# EAGLE board FlexEval (EAGLE 9.6.2)
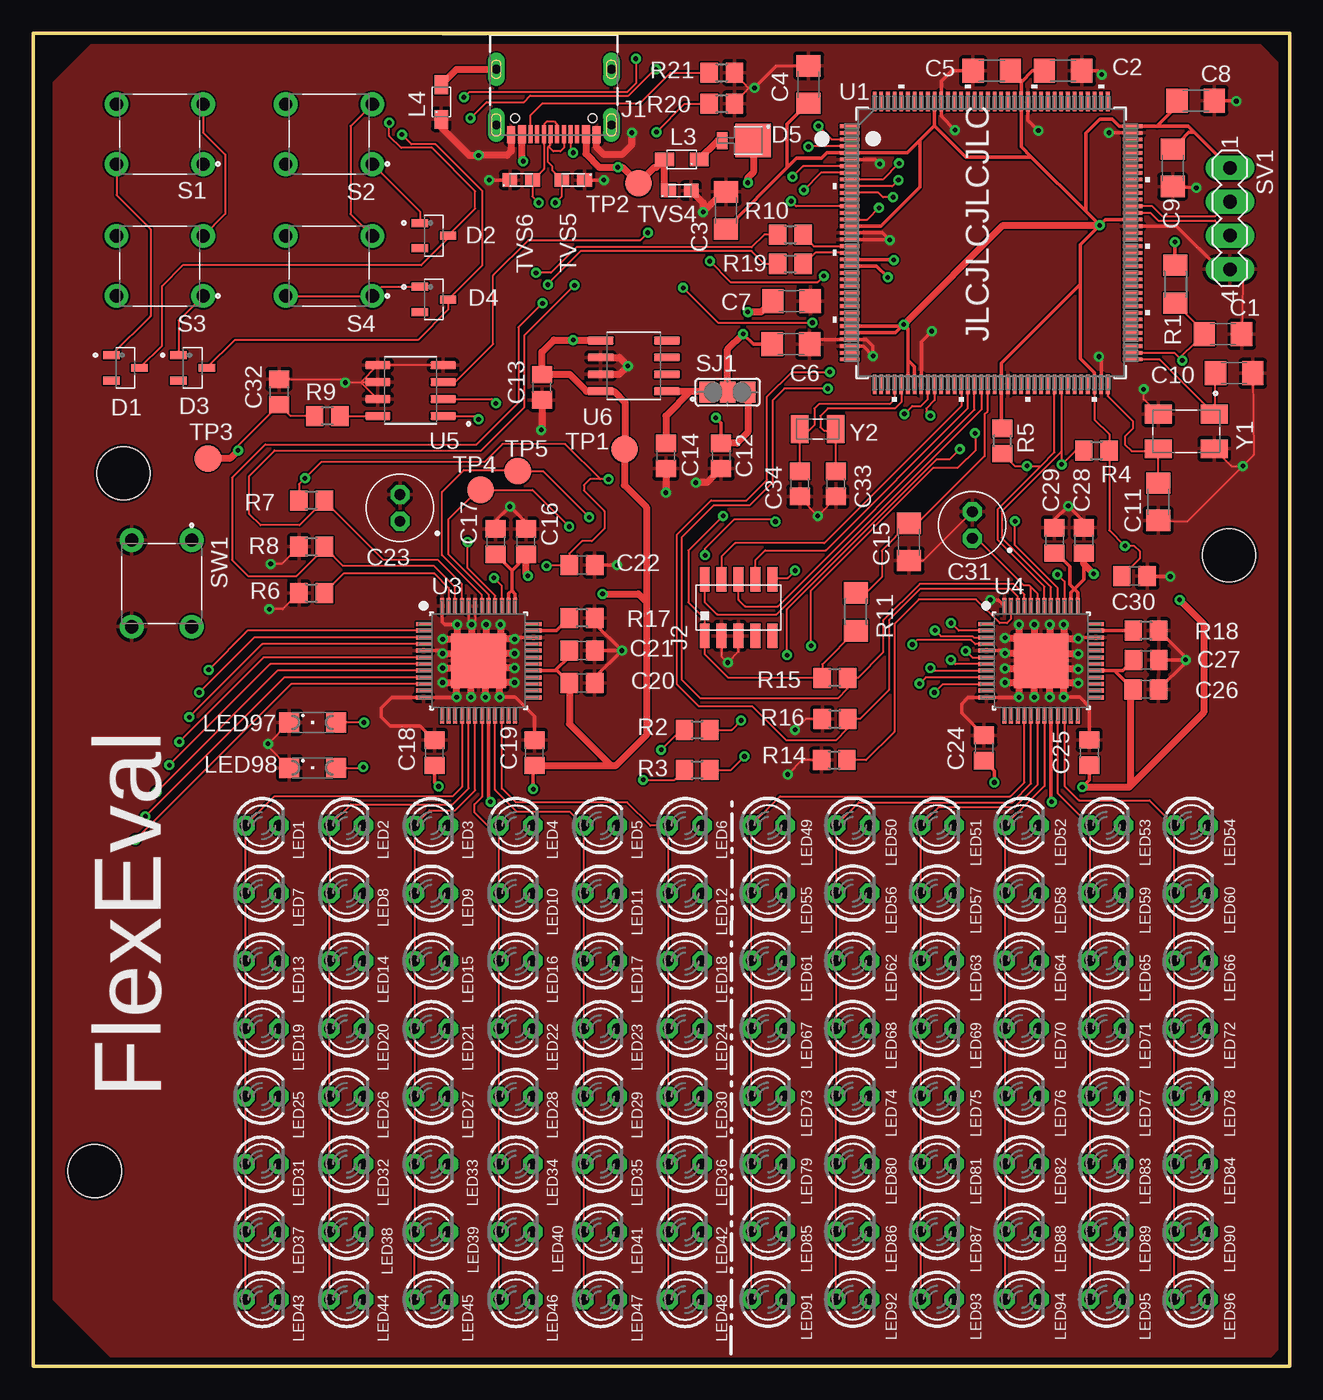
[diagram p5: board, top side]
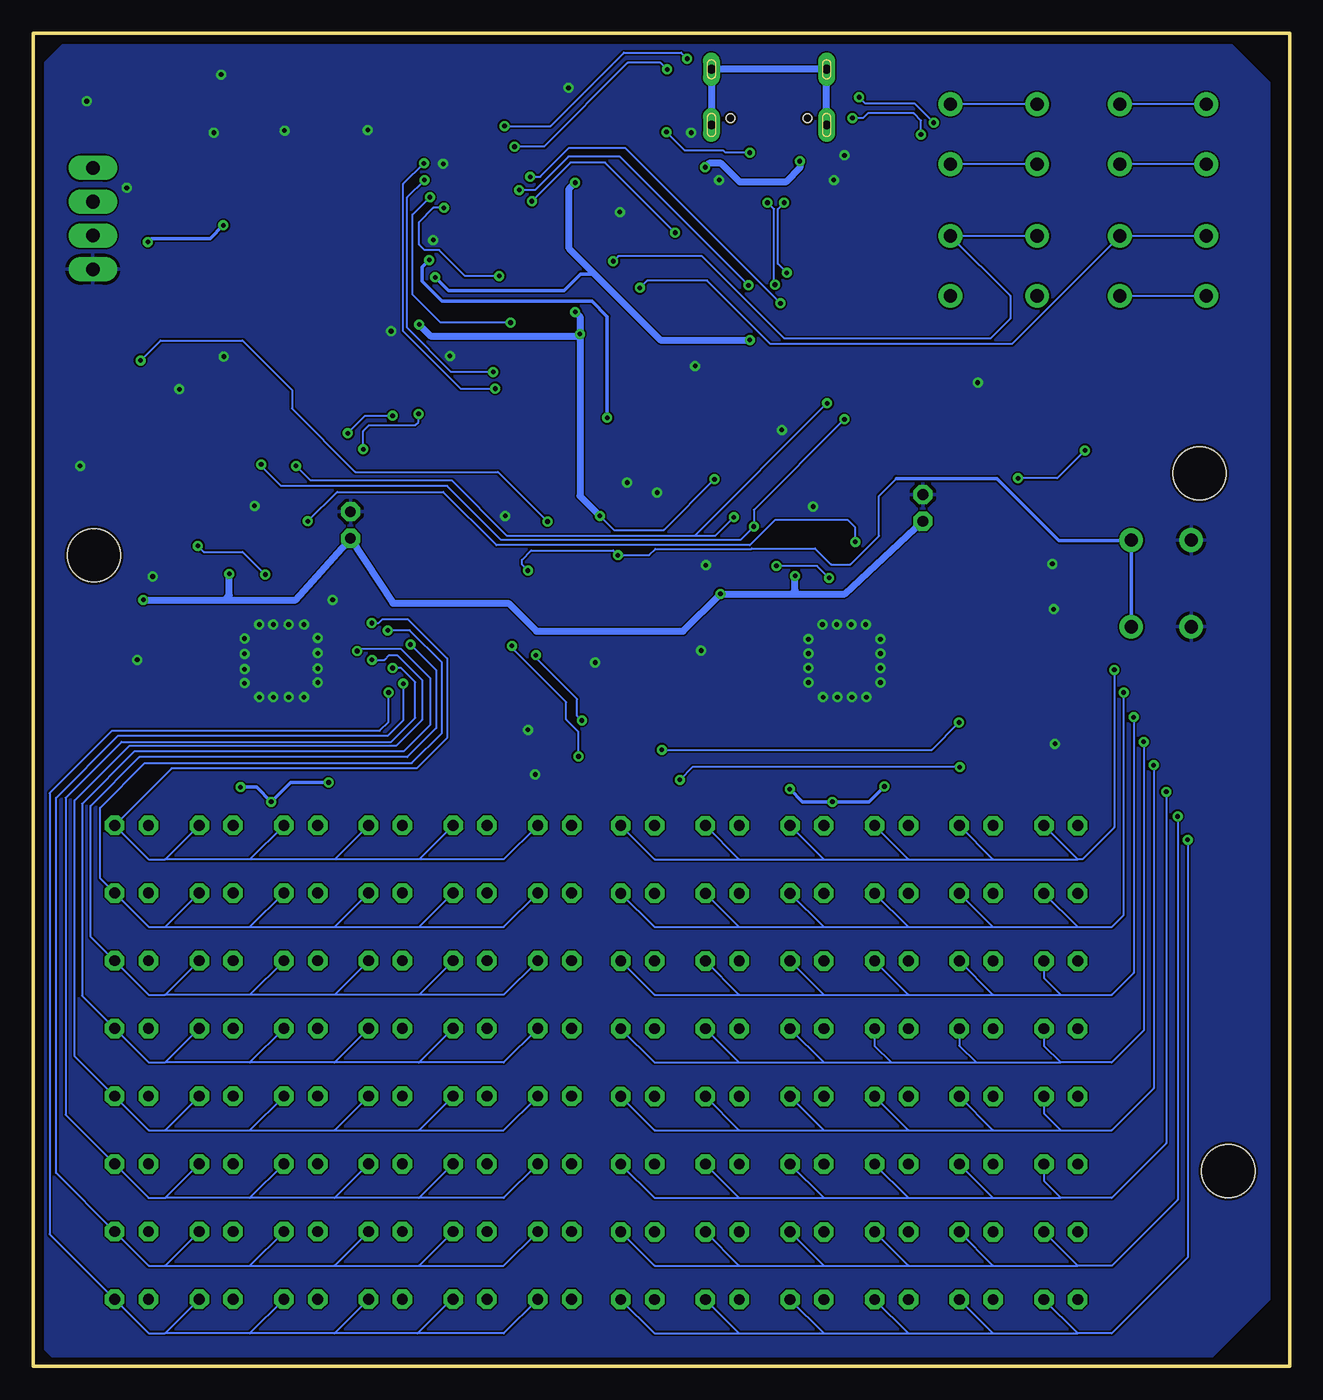
[diagram p6: board, bottom side, seen from below]

Size 94.25 x 100 mm. Coordinates in mm from the lower left corner, seen from the top.
Outline: 0,0 94.25,0 94.25,100 0,100 0,0
Copper layers (1*16): Top 0.035mm / dielectric 1.6mm / Bottom 0.035mm
Design rules "jlcpcb-2layers *": minimum track width 5mil, minimum drill 0.3mm, track to track 5mil, track to pad 5mil, pad to pad 5mil, via to via 0.5mm, smd to smd 5mil, copper to edge 0.2mm, drill to drill 6mil, minimum pad ring 0.3mm, minimum via ring 0.2mm, stop-mask expansion 4mil, vias tented up to drill 0mil, thermal gap 10mil
Holes 4 mm at 6.75,67 4.6,14.65 89.7,60.85

## Footprints (pad centres in the part's own frame; a part is rotated, then mirrored left to right if it is on the bottom)
C1206 = smd 1.6 x 1.8: 1 -1.4,0; 2 1.4,0
C0805 = smd 1.3 x 1.5: 1 -0.95,0; 2 0.95,0
860020672011 = drill 0.8 octagon: + 0,1; - 0,-1
SOT95P240X111-3N = smd 1.23 x 0.6: 1 -1.06,0.95; 2 -1.06,-0.95; 3 1.06,0
UPS115UE3/TR7 = smd 2.667 x 2.54: 1 -1.651,0 | smd 0.762 x 1.27: 2 0.686,0
GCT_USB4105-GF-A = smd 0.6 x 1.25: A1_B12 -3.2,4.905; B1_A12 3.2,4.905 | smd 0.6 x 1.35: A4_B9 -2.4,4.855; B4_A9 2.4,4.855 | smd 0.3 x 1.35: A5 -1.25,4.855; A6 -0.25,4.855; A7 0.25,4.855; A8 1.25,4.855; B5 1.75,4.855; B6 0.75,4.855; B7 -0.75,4.855; B8 -1.75,4.855 | drill 0.66 pad 1.05 long: S1 -4.32,4.18; S4 4.32,4.18 | drill 0.66 pad 1 long: S2 -4.32,0; S3 4.32,0 | hole 0.65: 2.89,3.68; -2.89,3.68
DEBUG = smd 1.854 x 0.737: 1 -2.121,2.54; 2 2.121,2.54; 3 -2.121,1.27; 4 2.121,1.27; 5 -2.121,0; 6 2.121,0; 7 -2.121,-1.27; 8 2.121,-1.27; 9 -2.121,-2.54; 10 2.121,-2.54
78285333 = smd 1.4 x 1: 1 -1.3,0; 2 1.3,0
LED3MM = drill 0.813 octagon: A -1.27,0; K 1.27,0
SML1206 = smd 1.5 x 1.5: A 1.75,0; C -1.75,0
R1206 = smd 1.6 x 1.803: 1 -1.422,0; 2 1.422,0
R0805 = smd 1.3 x 1.5: 1 -0.95,0; 2 0.95,0
SW_1825910-7 = drill 0.99: 1 -3.25,2.25; 2 3.25,2.25; 3 -3.25,-2.25; 4 3.25,-2.25
SJ_2 = smd 1.168 x 1.6: 1 -1.524,0; 2 0,0; 3 1.524,0
MA04-1 = drill 1.016 long: 1 -3.81,0; 2 -1.27,0; 3 1.27,0; 4 3.81,0
TP20R = smd 2 x 2: TP 0,0
0603ESDA2-TR2 = smd 1.1 x 1: 1 -0.85,0; 2 0.85,0
LQFP-144_20X20X1.6 = smd 1.461 x 0.27: 1 -10.498,8.75; 2 -10.498,8.25; 3 -10.498,7.75; 4 -10.498,7.25; 5 -10.498,6.75; 6 -10.498,6.25; 7 -10.498,5.75; 8 -10.498,5.25; 9 -10.498,4.75; 10 -10.498,4.25; 11 -10.498,3.75; 12 -10.498,3.25; 13 -10.498,2.75; 14 -10.498,2.25; 15 -10.498,1.75; 16 -10.498,1.25; 17 -10.498,0.75; 18 -10.498,0.25; 19 -10.498,-0.25; 20 -10.498,-0.75; 21 -10.498,-1.25; 22 -10.498,-1.75; 23 -10.498,-2.25; 24 -10.498,-2.75; 25 -10.498,-3.25; 26 -10.498,-3.75; 27 -10.498,-4.25; 28 -10.498,-4.75; 29 -10.498,-5.25; 30 -10.498,-5.75; 31 -10.498,-6.25; 32 -10.498,-6.75; 33 -10.498,-7.25; 34 -10.498,-7.75; 35 -10.498,-8.25; 36 -10.498,-8.75; 73 10.752,-8.75; 74 10.752,-8.25; 75 10.752,-7.75; 76 10.752,-7.25; 77 10.752,-6.75; 78 10.752,-6.25; 79 10.752,-5.75; 80 10.752,-5.25; 81 10.752,-4.75; 82 10.752,-4.25; 83 10.752,-3.75; 84 10.752,-3.25; 85 10.752,-2.75; 86 10.752,-2.25; 87 10.752,-1.75; 88 10.752,-1.25; 89 10.752,-0.75; 90 10.752,-0.25; 91 10.752,0.25; 92 10.752,0.75; 93 10.752,1.25; 94 10.752,1.75; 95 10.752,2.25; 96 10.752,2.75; 97 10.752,3.25; 98 10.752,3.75; 99 10.752,4.25; 100 10.752,4.75; 101 10.752,5.25; 102 10.752,5.75; 103 10.752,6.25; 104 10.752,6.75; 105 10.752,7.25; 106 10.752,7.75; 107 10.752,8.25; 108 10.752,8.75 | smd 0.27 x 1.461: 37 -8.623,-10.625; 38 -8.123,-10.625; 39 -7.623,-10.625; 40 -7.123,-10.625; 41 -6.623,-10.625; 42 -6.123,-10.625; 43 -5.623,-10.625; 44 -5.123,-10.625; 45 -4.623,-10.625; 46 -4.123,-10.625; 47 -3.623,-10.625; 48 -3.123,-10.625; 49 -2.623,-10.625; 50 -2.123,-10.625; 51 -1.623,-10.625; 52 -1.123,-10.625; 53 -0.623,-10.625; 54 -0.123,-10.625; 55 0.377,-10.625; 56 0.877,-10.625; 57 1.377,-10.625; 58 1.877,-10.625; 59 2.377,-10.625; 60 2.877,-10.625; 61 3.377,-10.625; 62 3.877,-10.625; 63 4.377,-10.625; 64 4.877,-10.625; 65 5.377,-10.625; 66 5.877,-10.625; 67 6.377,-10.625; 68 6.877,-10.625; 69 7.377,-10.625; 70 7.877,-10.625; 71 8.377,-10.625; 72 8.877,-10.625; 109 8.877,10.625; 110 8.377,10.625; 111 7.877,10.625; 112 7.377,10.625; 113 6.877,10.625; 114 6.377,10.625; 115 5.877,10.625; 116 5.377,10.625; 117 4.877,10.625; 118 4.377,10.625; 119 3.877,10.625; 120 3.377,10.625; 121 2.877,10.625; 122 2.377,10.625; 123 1.877,10.625; 124 1.377,10.625; 125 0.877,10.625; 126 0.377,10.625; 127 -0.123,10.625; 128 -0.623,10.625; 129 -1.123,10.625; 130 -1.623,10.625; 131 -2.123,10.625; 132 -2.623,10.625; 133 -3.123,10.625; 134 -3.623,10.625; 135 -4.123,10.625; 136 -4.623,10.625; 137 -5.123,10.625; 138 -5.623,10.625; 139 -6.123,10.625; 140 -6.623,10.625; 141 -7.123,10.625; 142 -7.623,10.625; 143 -8.123,10.625; 144 -8.623,10.625
IS31FL3733B-TQLS4 = smd 1.17 x 0.3: 1 -4.12,2.75; 2 -4.12,2.25; 3 -4.12,1.75; 4 -4.12,1.25; 5 -4.12,0.75; 6 -4.12,0.25; 7 -4.12,-0.25; 8 -4.12,-0.75; 9 -4.12,-1.25; 10 -4.12,-1.75; 11 -4.12,-2.25; 12 -4.12,-2.75; 25 4.12,-2.75; 26 4.12,-2.25; 27 4.12,-1.75; 28 4.12,-1.25; 29 4.12,-0.75; 30 4.12,-0.25; 31 4.12,0.25; 32 4.12,0.75; 33 4.12,1.25; 34 4.12,1.75; 35 4.12,2.25; 36 4.12,2.75 | smd 0.3 x 1.17: 13 -2.75,-4.12; 14 -2.25,-4.12; 15 -1.75,-4.12; 16 -1.25,-4.12; 17 -0.75,-4.12; 18 -0.25,-4.12; 19 0.25,-4.12; 20 0.75,-4.12; 21 1.25,-4.12; 22 1.75,-4.12; 23 2.25,-4.12; 24 2.75,-4.12; 37 2.75,4.12; 38 2.25,4.12; 39 1.75,4.12; 40 1.25,4.12; 41 0.75,4.12; 42 0.25,4.12; 43 -0.25,4.12; 44 -0.75,4.12; 45 -1.25,4.12; 46 -1.75,4.12; 47 -2.25,4.12; 48 -2.75,4.12 | smd 4.11 x 4.11: PAD 0,0
SOIC127P600X175-8N = smd 1.9 x 0.6: 1 -2.455,1.905; 2 -2.455,0.635; 3 -2.455,-0.635; 4 -2.455,-1.905; 5 2.455,-1.905; 6 2.455,-0.635; 7 2.455,0.635; 8 2.455,1.905
SOIC127P600X175-8N' = smd 1.95 x 0.59: 1 -2.48,1.905; 2 -2.48,0.635; 3 -2.48,-0.635; 4 -2.48,-1.905; 5 2.48,-1.905; 6 2.48,-0.635; 7 2.48,0.635; 8 2.48,1.905
OSC_ABM3B-8.000MHZ-B2-T = smd 1.4 x 2: 1 -1.3,2.1; 2 -1.3,-2.1; 3 1.3,-2.1; 4 1.3,2.1
XTAL_ABS07-32.768KHZ-T = smd 1.3 x 2.1: 1 -1.35,0; 2 1.35,0

## Placement (x,y rotation side)
C1  1000pF  [C1206]  89.26,77.43 0 top
C2  1uF  [C1206]  77.26,97.18 0 top
C3  1uF  [C1206]  51.97,86.71 90 top
C4  1uF  [C1206]  58.17,96.16 90 top
C5  100nF  [C1206]  71.91,97.18 0 top
C6  100nF  [C1206]  56.84,76.67 180 top
C7  100nF  [C1206]  56.89,79.92 180 top
C8  1uF  [C1206]  87.21,94.96 0 top
C9  100nF  [C1206]  85.49,89.91 90 top
C10  22pF  [C1206]  90.09,74.49 180 top
C11  22pF  [C1206]  84.39,64.86 90 top
C12  2.2uF  [C0805]  51.6,68.3 90 top
C13  4.7uF  [C0805]  38.15,73.45 90 top
C14  4.7uF  [C0805]  47.45,68.3 90 top
C15  1000pF  [C1206]  65.71,61.84 270 top
C16  0.1uF  [C0805]  36.96,61.87 90 top
C17  0.47uF  [C0805]  34.69,61.87 90 top
C18  0.1uF  [C0805]  30.09,46.02 90 top
C19  0.47uF  [C0805]  37.59,46.02 90 top
C20  0.1uF  [C0805]  41.17,51.26 0 top
C21  0.47uF  [C0805]  41.17,53.69 0 top
C22  0.47uF  [C0805]  41.17,60.11 0 top
C23  22uF  [860020672011]  27.51,64.39 180 top
C24  0.1uF  [C0805]  71.33,46.38 90 top
C25  0.47uF  [C0805]  79.23,46.03 90 top
C26  0.1uF  [C0805]  83.47,50.78 0 top
C27  0.47uF  [C0805]  83.49,52.98 0 top
C28  0.1uF  [C0805]  78.82,61.96 90 top
C29  0.47uF  [C0805]  76.62,61.96 90 top
C30  0.47uF  [C0805]  82.62,59.28 0 top
C31  22uF  [860020672011]  70.45,63.11 180 top
C32  0.1uF  [C0805]  18.44,73.1 90 top
C33  12pF  [C0805]  60.2,66.2 270 top
C34  12pF  [C0805]  57.5,66.2 270 top
D1  BAS16LT3G  [SOT95P240X111-3N]  6.91,74.9 0 top
D2  BAS16LT3G  [SOT95P240X111-3N]  30.06,84.82 0 top
D3  BAS16LT3G  [SOT95P240X111-3N]  11.96,74.9 0 top
D4  BAS16LT3G  [SOT95P240X111-3N]  30.06,80.03 0 top
D5  UPS115UE3/TR7  [UPS115UE3/TR7]  52.37,91.96 180 top
J1  USB4105-GF-A  [GCT_USB4105-GF-A]  39.05,97.3 180 top
J2  GRPB052VWQS-RC  [DEBUG]  52.91,56.92 90 top
L3  330  [78285333]  48.65,90.55 0 top
L4  330  [78285333]  30.6,94.85 270 top
LED1  [LED3MM]  17.16,40.56 0 top
LED2  [LED3MM]  23.51,40.56 0 top
LED3  [LED3MM]  29.86,40.56 0 top
LED4  [LED3MM]  36.21,40.56 0 top
LED5  [LED3MM]  42.56,40.56 0 top
LED6  [LED3MM]  48.91,40.56 0 top
LED7  [LED3MM]  17.16,35.48 0 top
LED8  [LED3MM]  23.51,35.48 0 top
LED9  [LED3MM]  29.86,35.48 0 top
LED10  [LED3MM]  36.21,35.48 0 top
LED11  [LED3MM]  42.56,35.48 0 top
LED12  [LED3MM]  48.91,35.48 0 top
LED13  [LED3MM]  17.16,30.4 0 top
LED14  [LED3MM]  23.51,30.4 0 top
LED15  [LED3MM]  29.86,30.4 0 top
LED16  [LED3MM]  36.21,30.4 0 top
LED17  [LED3MM]  42.56,30.4 0 top
LED18  [LED3MM]  48.91,30.4 0 top
LED19  [LED3MM]  17.16,25.32 0 top
LED20  [LED3MM]  23.51,25.32 0 top
LED21  [LED3MM]  29.86,25.32 0 top
LED22  [LED3MM]  36.21,25.32 0 top
LED23  [LED3MM]  42.56,25.32 0 top
LED24  [LED3MM]  48.91,25.32 0 top
LED25  [LED3MM]  17.16,20.24 0 top
LED26  [LED3MM]  23.51,20.24 0 top
LED27  [LED3MM]  29.86,20.24 0 top
LED28  [LED3MM]  36.21,20.24 0 top
LED29  [LED3MM]  42.56,20.24 0 top
LED30  [LED3MM]  48.91,20.24 0 top
LED31  [LED3MM]  17.16,15.16 0 top
LED32  [LED3MM]  23.51,15.16 0 top
LED33  [LED3MM]  29.86,15.16 0 top
LED34  [LED3MM]  36.21,15.16 0 top
LED35  [LED3MM]  42.56,15.16 0 top
LED36  [LED3MM]  48.91,15.16 0 top
LED37  [LED3MM]  17.16,10.08 0 top
LED38  [LED3MM]  23.51,10.08 0 top
LED39  [LED3MM]  29.86,10.08 0 top
LED40  [LED3MM]  36.21,10.08 0 top
LED41  [LED3MM]  42.56,10.08 0 top
LED42  [LED3MM]  48.91,10.08 0 top
LED43  [LED3MM]  17.16,5 0 top
LED44  [LED3MM]  23.51,5 0 top
LED45  [LED3MM]  29.86,5 0 top
LED46  [LED3MM]  36.21,5 0 top
LED47  [LED3MM]  42.56,5 0 top
LED48  [LED3MM]  48.91,5 0 top
LED49  [LED3MM]  55.13,40.58 0 top
LED50  [LED3MM]  61.48,40.58 0 top
LED51  [LED3MM]  67.83,40.58 0 top
LED52  [LED3MM]  74.18,40.58 0 top
LED53  [LED3MM]  80.53,40.58 0 top
LED54  [LED3MM]  86.88,40.58 0 top
LED55  [LED3MM]  55.13,35.5 0 top
LED56  [LED3MM]  61.48,35.5 0 top
LED57  [LED3MM]  67.83,35.5 0 top
LED58  [LED3MM]  74.18,35.5 0 top
LED59  [LED3MM]  80.53,35.5 0 top
LED60  [LED3MM]  86.88,35.5 0 top
LED61  [LED3MM]  55.13,30.42 0 top
LED62  [LED3MM]  61.48,30.42 0 top
LED63  [LED3MM]  67.83,30.42 0 top
LED64  [LED3MM]  74.18,30.42 0 top
LED65  [LED3MM]  80.53,30.42 0 top
LED66  [LED3MM]  86.88,30.42 0 top
LED67  [LED3MM]  55.13,25.34 0 top
LED68  [LED3MM]  61.48,25.34 0 top
LED69  [LED3MM]  67.83,25.34 0 top
LED70  [LED3MM]  74.18,25.34 0 top
LED71  [LED3MM]  80.53,25.34 0 top
LED72  [LED3MM]  86.88,25.34 0 top
LED73  [LED3MM]  55.13,20.26 0 top
LED74  [LED3MM]  61.48,20.26 0 top
LED75  [LED3MM]  67.83,20.26 0 top
LED76  [LED3MM]  74.18,20.26 0 top
LED77  [LED3MM]  80.53,20.26 0 top
LED78  [LED3MM]  86.88,20.26 0 top
LED79  [LED3MM]  55.13,15.18 0 top
LED80  [LED3MM]  61.48,15.18 0 top
LED81  [LED3MM]  67.83,15.18 0 top
LED82  [LED3MM]  74.18,15.18 0 top
LED83  [LED3MM]  80.53,15.18 0 top
LED84  [LED3MM]  86.88,15.18 0 top
LED85  [LED3MM]  55.13,10.1 0 top
LED86  [LED3MM]  61.48,10.1 0 top
LED87  [LED3MM]  67.83,10.1 0 top
LED88  [LED3MM]  74.18,10.1 0 top
LED89  [LED3MM]  80.53,10.1 0 top
LED90  [LED3MM]  86.88,10.1 0 top
LED91  [LED3MM]  55.13,5.02 0 top
LED92  [LED3MM]  61.48,5.02 0 top
LED93  [LED3MM]  67.83,5.02 0 top
LED94  [LED3MM]  74.18,5.02 0 top
LED95  [LED3MM]  80.53,5.02 0 top
LED96  [LED3MM]  86.88,5.02 0 top
LED97  GREEN  [SML1206]  20.95,48.3 0 top
LED98  RED  [SML1206]  20.95,44.9 0 top
R1  10k  [R1206]  85.69,81.18 90 top
R2  200  [R0805]  49.8,47.75 0 top
R3  200  [R0805]  49.8,44.75 0 top
R4  4.7K  [R0805]  79.77,68.71 0 top
R5  4.7K  [R0805]  72.72,69.42 90 top
R6  100K  [R0805]  20.88,58.01 0 top
R7  100K  [R0805]  20.88,64.96 180 top
R8  100K  [R0805]  20.88,61.48 0 top
R9  200  [R0805]  22.05,71.29 180 top
R10  33  [R0805]  56.8,84.9 0 top
R11  10k  [R1206]  61.71,56.6 270 top
R14  100K  [R0805]  60.09,45.48 0 top
R15  100K  [R0805]  60.14,51.65 180 top
R16  100K  [R0805]  60.14,48.56 0 top
R17  420K  [R0805]  41.17,56.13 180 top
R18  420K  [R0805]  83.48,55.19 180 top
R19  33  [R0805]  56.8,82.7 0 top
R20  5.1k  [R0805]  51.65,94.7 180 top
R21  5.1k  [R0805]  51.65,97.05 0 top
S1  1825910-7  [SW_1825910-7]  9.49,92.44 180 top
S2  1825910-7  [SW_1825910-7]  22.19,92.44 180 top
S3  1825910-7  [SW_1825910-7]  9.49,82.55 180 top
S4  1825910-7  [SW_1825910-7]  22.19,82.55 180 top
SJ1  [SJ_2]  52.09,73.08 0 top
SV1  [MA04-1]  89.78,86.1 270 top
SW1  1825910-7  [SW_1825910-7]  9.63,58.73 270 top
TP1  TPSQTP20R  [TP20R]  44.35,68.8 0 top
TP2  TPSQTP20R  [TP20R]  45.4,88.75 0 top
TP3  TPSQTP20R  [TP20R]  13.1,68.1 0 top
TP4  TPSQTP20R  [TP20R]  33.55,65.75 0 top
TP5  TPSQTP20R  [TP20R]  36.35,67.15 0 top
TVS4  [0603ESDA2-TR2]  48.5,88.2 0 top
TVS5  [0603ESDA2-TR2]  40.5,89 180 top
TVS6  [0603ESDA2-TR2]  36.6,89 0 top
U1  MK22FX512AVLQ12  [LQFP-144_20X20X1.6]  71.74,84.28 0 top
U3  IS31FL3733B-TQLS4  [IS31FL3733B-TQLS4]  33.41,52.93 0 top
U4  IS31FL3733B-TQLS4  [IS31FL3733B-TQLS4]  75.61,52.93 0 top
U5  SOIC127P600X175-8N  [SOIC127P600X175-8N]  28.3,73.2 180 top
U6  AP2115M-3.3TRG1  [SOIC127P600X175-8N']  45.05,75.05 180 top
Y1  ABM3B-8.000MHZ-B2-T  [OSC_ABM3B-8.000MHZ-B2-T]  86.51,70.13 270 top
Y2  ABS07-32.768KHZ-T  [XTAL_ABS07-32.768KHZ-T]  58.84,70.3 180 top

## Tracks (layer width: path | path; a pad name or v marks a point on that pad's centre or on a via)
CS1_CTRL1
  Top 0.152: LED43.A LED37.A LED31.A LED25.A LED19.A LED13.A LED7.A LED1.A 18.08,42.75 31.45,42.75 32.16,43.46 U3.16
CS1_CTRL2
  Top 0.152: LED91.A LED85.A LED79.A LED73.A LED67.A LED61.A LED55.A LED49.A 56.03,42.75 73.3,42.75 74.36,43.81 U4.16
CS2_CTRL1
  Top 0.152: LED44.A LED38.A LED32.A LED26.A LED20.A LED14.A LED8.A LED2.A 23.83,42.15 31.45,42.15 32.66,43.36 U3.17
CS2_CTRL2
  Top 0.152: LED92.A LED86.A LED80.A LED74.A LED68.A LED62.A LED56.A LED50.A 61.93,42.3 73.45,42.3 74.86,43.71 U4.17
CS3_CTRL1
  Top 0.152: LED45.A LED39.A LED33.A LED27.A LED21.A LED15.A LED9.A LED3.A 29.73,41.7 31.65,41.7 33.16,43.21 U3.18
CS3_CTRL2
  Top 0.152: LED93.A LED87.A LED81.A LED75.A LED69.A LED63.A LED57.A LED51.A 67.93,41.95 73.65,41.95 75.36,43.66 U4.18
CS4_CTRL1
  Top 0.152: LED46.A LED40.A LED34.A LED28.A LED22.A LED16.A LED10.A LED4.A 34.09,40.56 33.1,41.55 33.1,42.15 33.66,42.71 U3.19
CS4_CTRL2
  Top 0.152: LED94.A LED88.A LED82.A LED76.A LED70.A LED64.A LED58.A LED52.A 75.86,43.53 U4.19
CS5_CTRL1
  Top 0.152: LED47.A LED41.A LED35.A LED29.A LED23.A LED17.A LED11.A LED5.A 40.25,41.6 36.3,41.6 34.66,43.24 U3.21
CS5_CTRL2
  Top 0.152: LED95.A LED89.A LED83.A LED77.A LED71.A LED65.A LED59.A LED53.A 76.86,42.98 U4.21
CS6_CTRL1
  Top 0.152: LED48.A LED42.A LED36.A LED30.A LED24.A LED18.A LED12.A LED6.A 46.29,40.56 44.55,42.3 36.2,42.3 35.16,43.34 U3.22
CS6_CTRL2
  Top 0.152: LED96.A LED90.A LED84.A LED78.A LED72.A LED66.A LED60.A LED54.A 83.74,42.45 78.45,42.45 77.36,43.54 U4.22
EXTAL
  Top 0.152: C11.2 84.39,68.8 | 84.39,68.8 84.39,68.81 Y1.3 | U1.72 80.62,72.78 82.5,70.9 82.5,70.35 81.9,69.75 81.9,69.15 82.4,68.65 83.75,68.65 83.9,68.8 84.39,68.8
EXTAL32
  Top 0.152: Y2.1 60.19,70.2 | 60.19,70.2 C33.1 | U1.41 65.12,72.32 64.65,71.85 59.6,71.85 59.05,71.3 59.05,70.45 59.3,70.2 60.19,70.2
GND  (via drill 0.35)
  Top 0.152: U3.44 32.66,55.82 32.87,55.62 32.89,55.64 | 32.89,55.64 v32.88,55.65 | U3.43 33.16,55.91 32.89,55.64 | R21.2 53.63,95.9 v54.1,95.9 53.69,95.9 R20.1 | SV1.4 90.73,81.33 C1.2 | J2.3 51.64,53.26 v52.1,52.8 52.91,53.61 J2.5 | C34.2 57.5,65.15 v58.85,63.8 60.2,65.15 C33.2 | Y1.2 83.3,72.54 v83.3,73.3 | Y1.4 89.89,67.55 v90.75,67.55 | C10.1 91.56,68.36 v90.75,67.55 | C11.1 86.58,63.38 v90.75,67.55 | R6.1 18.71,56.8 v17.7,56.8 | R8.1 18.64,60.2 v17.8,60.2 | U5.6 25.81,73.8 24.61,73.8 | 24.54,73.8 U5.5 U5.4 | 24.54,73.8 v23.4,73.8 23.15,74.05 C32.2 | U5.7 24.61,73.8 | 24.61,73.8 24.54,73.8 | R14.1 57.68,45.48 v56.6,44.4 | R16.1 57.97,48.56 v57.15,47.75 | C15.2 66.78,60.44 C31.- | LED97.C v17.6,46.7 17.6,46.5 LED98.C
  Top 0.254: v73.95,50.2 73.93,50.18 U4.12 70.13,50.18 69.65,49.7 69.65,49 69.66,49 C24.2 | U4.34 78.48,54.68 v78.4,54.6 | U4.48 72.41,57.5 v71.8,57.5 | U4.5 72.72,53.68 v72.9,53.5 | C25.2 79.23,49.47 78.5,50.2 v77.3,50.2 | C26.2 86.45,52.81 v86.45,53 | C27.2 86.43,52.98 v86.45,53 | R18.1 86.45,53.17 v86.45,53 | C21.2 v44.14,53.69 v44.15,53.7 | v44.15,53.7 42.12,55.73 R17.1 | v44.15,53.7 42.12,51.67 C20.2 | C22.2 v43.79,60.11 v43.8,60.1 | v31.75,50.2 31.73,50.18 U3.12 26.88,50.18 26.1,49.4 26.1,48.7 26.75,48.05 29.01,48.05 C18.2 | U3.48 30.66,55.84 30.85,55.65 v31.8,55.65 | U3.34 36.23,54.68 v36.1,54.55 | C19.2 37.59,48.76 36.15,50.2 v35,50.2 | SV1.4 89.01,82.29 85.75,85.55 82.51,85.55 U1.93 | TVS5.1 v42.8,89 | TVS6.1 v34.2,89 | C17.2 34.69,63.44 v35.75,64.5 36.96,63.29 C16.2 | C29.2 76.62,63.52 v77.65,64.55 78.82,63.38 C28.2 | C30.2 83.6,59.25 v85.3,59.25 | C8.2 90.19,94.96 v90.25,94.9 | C9.1 87.22,88.44 v87.25,88.4 | U1.107 80.72,92.53 v80.7,92.55 | C2.2 79.87,97.18 v80.15,96.9 | U1.121 74.62,93.48 v75.4,92.7 | v69.15,92.75 68.12,93.78 U1.134 68.12,96.42 68.88,97.18 C5.1 | U1.71 80.12,75.58 v79.95,75.75 | C4.2 55.73,97.53 v54.1,95.9 | C6.1 58.67,77.03 U1.33 62.52,77.03 63,76.55 v63,75.8 62.27,76.53 U1.34 | U1.17 63.72,85.03 v64.25,84.5 64.22,84.53 U1.18 | U1.6 63.17,90.53 v63.5,90.2 | v67.4,77.65 66.62,76.87 U1.44 | U3.5 30.49,53.68 v30.7,53.47
  Top 0.508: 74.84,53.7 73.89,54.65 v72.9,54.65 | 74.84,53.7 U4.PAD | v72.9,53.5 74.15,53.5 | 74.15,53.5 74.65,53.5 74.84,53.7 | v72.9,52.35 75.03,52.35 | 75.03,52.35 U4.PAD | v72.9,51.3 73.98,51.3 | 73.98,51.3 75.03,52.35 | v78.4,53.45 77.15,53.45 | 77.15,53.45 76.13,53.45 U4.PAD | v78.4,52.3 76.45,52.3 | 76.45,52.3 76.24,52.3 U4.PAD | v76.25,50.2 76.25,51.25 | 76.25,51.25 76.25,52.1 76.45,52.3 | v75.1,50.2 75.1,52.28 75.03,52.35 | v73.95,50.2 73.98,50.23 73.98,51.3 | v78.4,51.25 77.3,51.25 | 77.3,51.25 76.25,51.25 | v77.3,50.2 77.3,51.25 | v76.25,55.65 76.25,53.57 U4.PAD | v75.1,55.65 75.1,53.44 U4.PAD | v77.3,55.65 77.3,54.55 | 77.3,54.55 77.3,53.6 77.15,53.45 | v73.95,55.65 73.95,53.7 74.15,53.5 | v78.4,54.6 78.35,54.55 77.3,54.55 | v30.7,53.47 32.87,53.47 | 32.87,53.47 U3.PAD | v30.7,52.38 32.86,52.38 | 32.86,52.38 U3.PAD | v36.1,53.47 33.95,53.47 | 33.95,53.47 U3.PAD | v36.1,52.38 33.96,52.38 | 33.96,52.38 U3.PAD | v33.92,50.2 33.92,51.3 | 33.92,51.3 33.92,52.34 33.96,52.38 | v32.83,50.2 32.83,51.4 | 32.83,51.4 32.83,52.35 32.86,52.38 | v30.7,51.3 31.7,51.3 | 31.7,51.3 32.73,51.3 32.83,51.4 | v36.1,51.3 35,51.3 | 35,51.3 33.92,51.3 | v35,50.2 35,51.3 | 35,51.3 | v31.75,50.2 31.75,51.25 31.7,51.3 | v32.88,55.65 32.88,54.5 | 32.88,54.5 32.88,53.48 32.87,53.47 | v33.97,55.65 33.97,54.5 | 33.97,54.5 33.97,53.49 33.95,53.47 | v36.1,54.55 35.1,54.55 | 35.1,54.55 34.02,54.55 33.97,54.5 | v30.7,54.55 31.75,54.55 | 31.75,54.55 32.83,54.55 32.88,54.5 | v31.8,55.65 31.8,54.6 31.75,54.55 | v35.05,55.65 35.05,54.6 35.1,54.55 | L4.2 30.6,92.95 32.7,90.85 v33.4,90.85 35.55,90.85 35.85,91.15 J1.B1_A12 | C13.1 38.15,70.3 v38.1,70.25 | U6.6 43.97,75.69 v44.6,75.05 43.97,74.42 U6.7
  Top 0.508: C14.1 v47.45,65.55 | C12.1 50.55,66.3 v49.7,66.3 | TVS4.2 50.25,87.3 v50.25,86.6 51.73,88.08 C3.2 | v44.9,92.55 44.9,91.65 44.15,90.9 42.8,90.9 42.24,91.46 42.24,92.53 J1.A1_B12
  pour Bottom: 92.79,0.75 93.31,1.27 93.31,97.79 92.04,99.06 4.34,99.06 1.57,96.29 1.57,5.03 5.8,0.8
  pour Top: 1.57,96.29 1.57,5.03 5.8,0.8 92.84,0.8 93.31,1.27 93.31,97.79 92.04,99.06 4.34,99.06
I2C2_SCL  (via drill 0.35)
  Top 0.152: U4.42 75.86,58.49 72.35,62 72.35,64.3 75.6,67.55 | U1.64 76.62,68.57 75.6,67.55 | U3.42 33.66,57.84 30.65,60.85 30.65,65.6 32.3,67.25 36.25,67.25 TP5.TP 38.25,67.15 v41.7,63.7 | 75.6,67.55 v74.55,67.55 73.64,67.55 R5.1 | U5.2 34.38,72.56 v34.7,72.25
  Bottom 0.152: v74.55,67.55 73.45,66.45 62.85,66.45 58.7,62.3 44.65,62.3 | v34.7,72.25 44.65,62.3 | v41.7,63.7 43.1,62.3 44.65,62.3
I2C2_SDA  (via drill 0.35)
  Top 0.127: 77.12,68.62 77.12,68.65 77.15,68.62 | R4.1 78.21,68.71
  Top 0.152: U4.41 76.36,58.44 72.65,62.15 72.65,64.15 77.12,68.62 | U1.65 77.12,68.65 | U3.41 34.16,57.89 31.15,60.9 31.15,63.55 33.35,65.75 TP4.TP 37.45,65.75 v40.2,63 | 77.15,68.62 v77.15,67.65 78.21,68.71 | U5.1 33.16,71.3 v33.4,71.05
  Bottom 0.127: 77.15,67.55 v77.15,67.65
  Bottom 0.152: 77.15,67.55 75.65,66.05 63.2,66.05 59.15,62 41.2,62 v40.2,63 40.2,64.25 v33.4,71.05
IICRST_LED_CTRL1
  Top 0.152: U3.47 31.16,58.39 30.09,59.46 23.27,59.46 R6.2
IICRST_LED_CTRL_2
  Top 0.152: U4.47 73.36,56.06 73.05,55.75 72.5,55.75 70.72,57.53 66.43,57.53 64.6,55.7 64.6,47.6 62.48,45.48 R14.2
INTB_LED_CTRL_1  (via drill 0.35)
  Top 0.152: U3.45 32.16,58.69 30.35,60.5 26.29,60.5 R7.1 19.96,63.1 17.05,63.1 16.2,63.95 16.2,66.8 18.1,68.7 33.6,68.7 36.85,71.95 36.85,77.35 v40.6,81.1 | U1.8 59.08,89.53 v57.8,88.25
  Bottom 0.152: v40.6,81.1 50.25,90.75 54.1,90.75 56.6,88.25 v57.8,88.25
INTB_LED_CTRL_2  (via drill 0.35)
  Top 0.152: U4.45 74.36,57.89 73.55,58.7 66.51,58.7 63.75,55.94 63.75,53.55 61.85,51.65 R15.1 61.09,50.84 60.35,50.1 50.05,50.1 48.65,51.5 48.65,62.2 51.05,64.6 53.75,64.6 55.5,66.35 55.5,72.5 56.35,73.35 v59.6,73.35 | U1.9 63.73,89.03 v64.95,90.25
  Bottom 0.152: v64.95,90.25 66.5,88.7 66.5,77.65 62.2,73.35 v59.6,73.35
JTAG_TCLK/SWD_CLK
  Top 0.152: U1.50 69.62,72.02 59.35,61.75 52.65,61.75 51.64,60.74 J2.4
JTAG_TDI
  Top 0.152: J2.8 54.18,60.48 54.9,61.2 59.45,61.2 70.12,71.87 U1.51
JTAG_TDO/TRACE_SWO
  Top 0.152: U1.52 70.62,71.77 55.85,57 53.4,57 52.91,57.49 J2.6
JTAG_TMS/SWD_DIO
  Top 0.152: J2.2 50.37,57.33 51.3,56.4 55.75,56.4 71.12,71.77 U1.53
LED_CTRL_SYNC  (via drill 0.35)
  Top 0.152: U4.40 76.86,58.39 73.65,61.6 v73.65,63.4 | U3.40 34.66,57.82 32.58,59.9 v32.58,61.85
  Bottom 0.152: v73.65,63.4 71.45,65.6 63.5,65.6 59.5,61.6 40.5,61.6 38.6,63.5 33.15,63.5 32.58,62.93 v32.58,61.85
MATRIX_C1  (via drill 0.35)
  Top 0.152: S1.3 12.74,92.56 14.4,90.9 14.4,86.46 S3.3 | v48.75,80.9 51.35,78.3 v58.45,78.3 | v64.5,87.7 63.75,87.7 63.42,88.03 U1.11
  Bottom 0.152: S1.4 S1.3 | S3.4 S3.3 20.84,76.7 38.95,76.7 43.7,81.45 48.2,81.45 v48.75,80.9 | v58.45,78.3 63.7,78.3 65.8,80.4 65.8,86.4 v64.5,87.7
MATRIX_C2  (via drill 0.35)
  Top 0.152: S2.3 23.8,93.05 23.8,86.44 S4.3 | v50.75,82.9 52.3,81.35 58.85,81.35 v59.3,81.8 | v63.45,86.9 62.58,86.03 U1.15
  Bottom 0.152: S4.4 S4.3 20.95,80.31 20.95,78.6 22.45,77.1 37.9,77.1 44.09,83.29 50.36,83.29 v50.75,82.9 | S2.4 S2.3 | v59.3,81.8 61.85,81.8 63.8,83.75 64.9,83.75 65.3,84.15 65.3,85.85 64.25,86.9 v63.45,86.9
MATRIX_R1  (via drill 0.35)
  Top 0.152: D1.3 9.65,76.58 9.65,81.05 11.2,82.6 29.11,82.6 31.12,84.61 D2.3 33.15,86.85 33.15,88.15 29.9,91.4 27.6,91.4 26.7,92.3 v26.7,93.3 | U1.3 59.92,92.03 v58.9,93.05 | v32.3,95.2 32.7,95.6 44.55,95.6 45.2,96.25 v45.2,98.1
  Bottom 0.152: v26.7,93.3 28.15,94.75 31.85,94.75 v32.3,95.2 | v58.9,93.05 55.45,93.05 49.95,98.55 45.65,98.55 v45.2,98.1
MATRIX_R2  (via drill 0.35)
  Top 0.152: D3.3 15.12,77 28.85,77 31.12,79.27 D4.3 33.7,82.61 33.7,88.15 30.17,91.68 28.37,91.68 v27.65,92.4 | v32.8,93.64 34.01,94.85 36.8,94.85 37.27,95.32 44.67,95.32 46.65,97.3 v46.7,97.3 | U1.4 58.18,91.53 v58.15,91.5
  Bottom 0.152: v27.65,92.4 27.65,93.45 28.2,94 31.65,94 32.01,93.64 v32.8,93.64 | v58.15,91.5 55.95,91.5 49.66,97.79 47.19,97.79 v46.7,97.3
MCU_LED1  (via drill 0.35)
  Top 0.152: v56.55,53.35 56.55,56.8 67.8,68.05 68.75,68.05 v69.5,68.8 | R2.2 52.4,47.75 v53.1,48.45 | v65.35,71.45 65.95,72.05 66.6,72.05 67.12,72.57 U1.45
  Bottom 0.152: v56.55,53.35 56.55,53.15 53.45,50.05 53.45,48.8 v53.1,48.45 | v65.35,71.45 65.35,70.85 65.6,70.6 69.05,70.6 69.5,70.15 v69.5,68.8
MCU_LED2  (via drill 0.35)
  Top 0.152: R3.2 52.35,44.75 v53.35,45.75 | v58.35,54.05 58.35,58.21 67.54,67.4 69.35,67.4 70.7,68.75 70.7,69.95 v70.65,70 | v67.3,71.31 67,71.61 67,71.85 67.62,72.47 U1.46
  Bottom 0.152: v53.35,45.75 53.35,47.6 54.27,48.52 54.27,49.83 58.35,53.9 v58.35,54.05 | v67.3,71.31 69.34,71.31 v70.65,70
N$1  (via drill 0.35)
  Top 0.152: R2.1 48.6,47.75 v47.1,46.25 | v24.8,48.3 LED97.A
  Bottom 0.152: v47.1,46.25 26.85,46.25 v24.8,48.3
N$2  (via drill 0.35)
  Top 0.152: LED98.A 24.7,44.9 v24.75,44.95 | v45.75,44 48.1,44 R3.1
  Bottom 0.152: v24.75,44.95 44.8,44.95 v45.75,44
N$4
  Top 0.254: U3.35 39.27,55.18 R17.2
N$5
  Top 0.254: U4.35 R18.2
N$6
  Top 0.152: S1.2 6.24,87.86 8.8,85.3 8.8,78.8 D1.1
  Bottom 0.152: S1.2 S1.1
N$8
  Top 0.152: S2.1 29,86.63 D2.1
  Bottom 0.152: S2.2 S2.1
N$9
  Top 0.152: S3.1 10.9,78.46 D3.1
  Bottom 0.152: S3.2 S3.1
N$10
  Top 0.152: D4.1 26.12,80.98 S4.1 S4.2
N$11
  Top 0.152: R9.1 U5.8
N$12
  Top 0.508: L4.1 31.75,97.3 J1.S3
  Bottom 0.508: J1.S4 J1.S3 J1.S2 J1.S1
N$13
  Top 0.152: J1.B5 37.3,93.85 38.2,94.75 45.5,94.75 47.8,97.05 R21.1
N$14  (via drill 0.35)
  Top 0.152: R20.2 50.81,94.71 48.86,94.71 v46.75,92.6 | v40.5,91.05 40.3,91.25 J1.A5
  Bottom 0.152: v40.5,91.05 42.33,91.05 42.49,91.2 45.35,91.2 v46.75,92.6
NMI
  Top 0.152: U1.54 71.62,71.67 71.37,71.42 71.37,68.27 66.33,63.24 C15.1 63.65,61.18 63.65,59.2 62.47,58.02 R11.1
RESET  (via drill 0.35)
  Top 0.152: U1.74 85.62,76.03 v86.2,75.45 86.2,75.84 C1.1 87.84,77.57 R1.1 | J2.10 55.56,59.15 56.6,59.15 v57.15,59.7 | v50.4,60.85 50.4,61.35 52.6,63.55 55.5,63.55 v55.67,63.38
  Bottom 0.152: v55.67,63.38 59.4,67.1 70.1,67.1 74.85,71.85 74.85,73.25 78.55,76.95 84.7,76.95 v86.2,75.45 | v57.15,59.7 57.6,60.15 57.6,60.5 56.9,61.2 50.75,61.2 v50.4,60.85 48.05,60.85 47.58,61.32 40.38,61.32 40.35,61.35 35.6,61.35 34.4,60.15 32.95,60.15 30.8,62.3 30.8,65.3 29.5,66.6
  Bottom 0.254: 29.5,66.6 21.95,66.6 17.3,61.95 11.91,61.95 SW1.1 SW1.2
SDB_LED_CTRL_1  (via drill 0.35)
  Top 0.152: U3.46 31.66,58.44 30.05,60.05 23.26,60.05 21.88,61.43 | 21.88,61.43 R8.2 | v38.2,79.75 36.4,77.95 36.4,72.3 33.25,69.15 17.4,69.15 14.9,66.65 14.9,60.5 16.1,59.3 19.75,59.3 21.88,61.43 | v56.97,89.23 57.76,90.03 U1.7
  Bottom 0.152: v38.2,79.75 49.85,91.4 54.05,91.4 56.22,89.23 v56.97,89.23
SDB_LED_CTRL_2  (via drill 0.35)
  Top 0.152: U4.46 73.86,57.74 73.31,58.3 66.5,58.3 64.2,55.99 64.2,50.75 62.02,48.56 R16.2 61.09,47.84 60.2,46.95 56.5,46.95 53.95,49.5 49.95,49.5 48.3,51.15 48.3,62.4 50.85,64.95 53.5,64.95 55.05,66.5 55.05,72.75 56.9,74.6 v59.75,74.6 | v64.9,88.99 64.44,88.53 U1.10
  Bottom 0.152: v64.9,88.99 66.2,87.69 66.2,77.9 62.9,74.6 v59.75,74.6
SW1_CTRL1  (via drill 0.35)
  Top 0.152: v13.15,52.25 16.08,55.18 U3.2
  Bottom 0.152: LED6.K 47.64,38.02 41.29,38.02 | 41.29,38.02 34.94,38.02 | 34.94,38.02 28.59,38.02 | 28.59,38.02 22.24,38.02 | 22.24,38.02 15.89,38.02 | 15.89,38.02 15.55,38.02 13.15,40.42 v13.15,52.25 | LED5.K 41.29,38.02 | LED3.K 28.59,38.02 | LED2.K 22.24,38.02 | LED1.K 15.89,38.02 | LED4.K 34.94,38.02
SW1_CTRL2  (via drill 0.35)
  Top 0.152: U4.2 69.44,55.18 v68.86,55.76
  Bottom 0.152: LED49.K 58.96,38.02 65.31,38.02 | 65.31,38.02 71.66,38.02 | 71.66,38.02 78.01,38.02 | 78.01,38.02 84.36,38.02 | LED50.K 65.31,38.02 | LED51.K 71.66,38.02 | LED52.K 78.01,38.02 | LED53.K 84.36,38.02 | 84.36,38.02 85.61,38.02 88.15,40.56 LED54.K 83.88,44.85 65.5,44.85 63.2,47.15 63.2,53.1 66.15,56.05 68.05,56.05 68.34,55.76 v68.86,55.76
SW2_CTRL1  (via drill 0.35)
  Top 0.152: v12.45,50.55 16.58,54.68 U3.3
  Bottom 0.152: LED12.K 47.64,32.94 41.29,32.94 | 41.29,32.94 34.94,32.94 | 34.94,32.94 28.59,32.94 | 28.59,32.94 22.24,32.94 | 22.24,32.94 15.89,32.94 | 15.89,32.94 13.35,32.94 12.45,33.84 v12.45,50.55 | LED7.K 15.89,32.94 | LED8.K 22.24,32.94 | LED9.K 28.59,32.94 | LED10.K 34.94,32.94 | LED11.K 41.29,32.94
SW2_CTRL2  (via drill 0.35)
  Top 0.152: v67.65,55.2 68.08,54.78 70.47,54.78 70.56,54.68 U4.3
  Bottom 0.152: LED55.K 58.96,32.94 65.31,32.94 | 84.36,32.94 78.01,32.94 | 78.01,32.94 71.66,32.94 | 71.66,32.94 65.31,32.94 | LED59.K 84.36,32.94 | LED58.K 78.01,32.94 | LED57.K 71.66,32.94 | LED56.K 65.31,32.94 | 84.36,32.94 85.59,32.94 LED60.K 89.25,36.6 89.25,41.9 85.9,45.25 65.86,45.25 63.6,47.51 63.6,52.8 66.01,55.2 v67.65,55.2
SW3_CTRL1  (via drill 0.35)
  Top 0.152: U3.4 17.18,54.18 v11.7,48.7
  Bottom 0.152: LED18.K 47.64,27.86 41.29,27.86 | 41.29,27.86 34.94,27.86 | 34.94,27.86 28.59,27.86 | 28.59,27.86 22.24,27.86 | 22.24,27.86 17.16,27.86 | 17.16,27.86 13.35,27.86 11.7,29.51 v11.7,48.7 | LED13.K 18.43,29.13 17.16,27.86 | LED14.K 22.24,27.86 | LED15.K 28.59,27.86 | LED16.K 34.94,27.86 | LED17.K 41.29,27.86
SW3_CTRL2  (via drill 0.35)
  Top 0.152: U4.4 70.67,54.18 70.35,54.5 66.3,54.5 v65.95,54.15
  Bottom 0.152: LED61.K 58.96,27.86 65.31,27.86 | 65.31,27.86 71.66,27.86 | 71.66,27.86 78.01,27.86 | 78.01,27.86 84.36,27.86 84.35,27.87 | LED62.K 65.31,27.86 | LED63.K 71.66,27.86 | LED64.K 78.01,27.86 | LED65.K 84.35,27.87 | 84.35,27.87 85.6,27.87 LED66.K 89.95,32.22 89.95,42.05 86.3,45.7 66.2,45.7 64.02,47.88 64.02,52.22 v65.95,54.15
SW4_CTRL1  (via drill 0.35)
  Top 0.152: U3.6 17.28,53.18 v10.95,46.85
  Bottom 0.152: LED24.K 47.64,22.78 41.29,22.78 | 41.29,22.78 34.94,22.78 | 34.94,22.78 29.86,22.78 | 29.86,22.78 23.51,22.78 | 23.51,22.78 17.16,22.78 | 17.16,22.78 13.35,22.78 10.95,25.18 v10.95,46.85 | LED19.K 18.43,24.05 17.16,22.78 | LED20.K 24.78,24.05 23.51,22.78 | LED21.K 31.13,24.05 29.86,22.78 | LED22.K 34.94,22.78 | LED23.K 41.29,22.78
SW4_CTRL2  (via drill 0.35)
  Top 0.152: v69.96,53.66 70.44,53.18 U4.6
  Bottom 0.152: LED67.K 58.96,22.78 65.31,22.78 | 65.31,22.78 71.66,22.78 | 71.66,22.78 78.01,22.78 | 78.01,22.78 84.36,22.78 | LED68.K 65.31,22.78 | LED69.K 71.66,22.78 | LED70.K 78.01,22.78 | LED71.K 84.36,22.78 | 84.36,22.78 85.59,22.78 LED72.K 90.6,27.79 90.6,42.2 86.65,46.15 66.45,46.15 64.45,48.15 64.45,51.6 66.65,53.8 69.82,53.8 v69.96,53.66
SW5_CTRL1  (via drill 0.35)
  Top 0.152: U3.7 17.78,52.68 v10.2,45.1
  Bottom 0.152: LED30.K 47.64,17.7 41.29,17.7 | 41.29,17.7 34.94,17.7 | 34.94,17.7 28.59,17.7 | 28.59,17.7 22.24,17.7 | 22.24,17.7 17.16,17.7 | 17.16,17.7 13.35,17.7 10.2,20.85 v10.2,45.1 | LED25.K 18.43,18.97 17.16,17.7 | LED26.K 22.24,17.7 | LED27.K 28.59,17.7 | LED29.K 41.29,17.7 | LED28.K 34.94,17.7
SW5_CTRL2  (via drill 0.35)
  Top 0.152: U4.7 69.17,52.68 v68.85,53
  Bottom 0.152: LED73.K 58.96,17.7 65.31,17.7 | 84.36,17.7 78.01,17.7 | 78.01,17.7 71.66,17.7 | 71.66,17.7 65.31,17.7 | LED77.K 84.36,17.7 | LED76.K 78.01,17.7 | LED75.K 71.66,17.7 | LED74.K 65.31,17.7 | 84.36,17.7 85.59,17.7 LED78.K 91.15,23.26 91.15,42.45 87.05,46.55 67.05,46.55 65.1,48.5 65.1,51.5 66.95,53.35 67.55,53.35 67.9,53 v68.85,53
SW6_CTRL1  (via drill 0.35)
  Top 0.152: U3.8 18.33,52.18 v9.25,43.1
  Bottom 0.152: LED36.K 47.64,12.62 41.29,12.62 | 41.29,12.62 34.94,12.62 | 34.94,12.62 28.59,12.62 | 28.59,12.62 22.24,12.62 | 22.24,12.62 17.16,12.62 | 17.16,12.62 13.35,12.62 9.25,16.72 v9.25,43.1 | LED31.K 18.43,13.89 17.16,12.62 | LED32.K 22.24,12.62 | LED33.K 28.59,12.62 | LED34.K 34.94,12.62 | LED35.K 41.29,12.62
SW6_CTRL2  (via drill 0.35)
  Top 0.152: v67.3,52.38 67.5,52.18 U4.8
  Bottom 0.152: LED79.K 58.96,12.62 65.31,12.62 | 65.31,12.62 71.66,12.62 | 71.66,12.62 78.01,12.62 | 78.01,12.62 84.36,12.62 84.35,12.63 | LED80.K 65.31,12.62 | LED81.K 71.66,12.62 | LED82.K 78.01,12.62 | LED83.K 84.35,12.63 | 84.35,12.63 85.6,12.63 LED84.K 91.83,18.86 91.83,42.65 87.63,46.85 67.4,46.85 65.6,48.65 65.6,51.31 66.67,52.38 v67.3,52.38
SW7_CTRL1  (via drill 0.35)
  Top 0.152: U3.9 18.83,51.68 v8.4,41.25
  Bottom 0.152: LED42.K 47.64,7.54 41.29,7.54 | 41.29,7.54 34.94,7.54 | 34.94,7.54 28.59,7.54 | 28.59,7.54 22.24,7.54 | 22.24,7.54 15.89,7.54 | 15.89,7.54 13.35,7.54 8.4,12.49 v8.4,41.25 | LED37.K 15.89,7.54 | LED38.K 22.24,7.54 | LED39.K 28.59,7.54 | LED40.K 34.94,7.54 | LED41.K 41.29,7.54
SW7_CTRL2  (via drill 0.35)
  Top 0.152: U4.9 66.96,51.68 v66.49,51.21
  Bottom 0.152: LED85.K 58.96,7.54 65.31,7.54 | 84.36,7.54 78.01,7.54 | 78.01,7.54 71.66,7.54 | 71.66,7.54 65.31,7.54 | LED89.K 84.36,7.54 | LED88.K 78.01,7.54 | LED87.K 71.66,7.54 | LED86.K 65.31,7.54 | 84.36,7.54 85.59,7.54 LED90.K 92.55,14.5 92.55,42.65 87.9,47.3 67.65,47.3 66.49,48.46 v66.49,51.21
SW8_CTRL1  (via drill 0.35)
  Top 0.152: U3.10 19.33,51.18 v7.65,39.5
  Bottom 0.152: LED48.K 47.64,2.46 41.29,2.46 | 41.29,2.46 34.94,2.46 | 34.94,2.46 28.59,2.46 | 28.59,2.46 22.24,2.46 | 22.24,2.46 15.89,2.46 | 15.89,2.46 13.35,2.46 7.65,8.16 v7.65,39.5 | LED43.K 15.89,2.46 | LED44.K 22.24,2.46 | LED45.K 28.59,2.46 | LED46.K 34.94,2.46 | LED47.K 41.29,2.46
SW8_CTRL2  (via drill 0.35)
  Top 0.152: v67.6,50.55 68.23,51.18 U4.10
  Bottom 0.152: LED91.K 58.96,2.46 65.42,2.46 | 65.42,2.46 71.66,2.46 | 71.66,2.46 78.01,2.46 | 78.01,2.46 84.36,2.46 | LED92.K 62.86,5.02 65.42,2.46 | LED93.K 71.66,2.46 | LED94.K 78.01,2.46 | LED95.K 84.36,2.46 | 84.36,2.46 85.59,2.46 LED96.K 93.03,9.9 93.03,43 88.34,47.69 68.26,47.69 67.6,48.35 v67.6,50.55
TEMP_ALERT  (via drill 0.35)
  Top 0.152: U5.3 31.64,73.83 34.5,76.7 34.5,81.85 37.15,84.5 45.55,84.5 v46.1,85.05 | U1.13 57.22,87.03 v56.85,87.4
  Bottom 0.152: v46.1,85.05 51.35,90.3 53.95,90.3 v56.85,87.4
UART0_RX
  Top 0.152: U1.95 83.82,86.53 84.4,85.95 88.66,85.95 SV1.3
UART0_TX
  Top 0.152: SV1.2 88.66,86.25 84.75,86.25 83.95,87.05 82.51,87.05 U1.96
USB_MCU_N
  Top 0.152: U1.20 58.68,83.53 57.85,82.7 R19.2
USB_MCU_P
  Top 0.152: R10.2 57.75,84.85 58.55,84.03 U1.19
USB_N  (via drill 0.35)
  Top 0.152: 38.64,91.51 38.8,91.67 J1.A7 | 38.64,91.51 38.59,91.45 38.59,90.36 38.93,90.03 38.93,89.72 TVS5.2 39.65,87.78 v39.16,87.3 | R19.1 54.85,82.7 53.89,83.66 41.06,83.66 38.6,81.2 v38.6,81.15 | J1.B7 39.8,91.4 39.55,91.15 39,91.15 38.64,91.51
  Bottom 0.152: v38.6,81.15 38.68,81.23 38.68,86.81 v39.16,87.3
USB_P  (via drill 0.35)
  Top 0.152: R10.1 54.85,84.9 53.89,83.94 40.74,83.94 38.84,82.03 v37.72,82.03 | v37.91,87.3 37.9,87.3 37.45,87.75 TVS6.2 37.5,89 38.31,89.81 38.31,91.66 38.3,91.67 J1.B6 38.37,92.55 38.37,93.23 38.54,93.4 39.06,93.4 39.3,93.16 J1.A6
  Bottom 0.152: v37.72,82.03 38.4,82.72 38.4,86.81 v37.91,87.3
VBUS  (via drill 0.35)
  Top 0.508: TVS4.1 47.35,88.5 L3.1 46.75,89.95 46.6,89.95 TP2.TP 44.2,89.95 v43.85,89.95 42.45,89.95 41.45,90.95 J1.A4_B9 | v36.75,90.4 36.65,90.5 J1.B4_A9
  Bottom 0.508: v36.75,90.4 36.75,89.9 37.8,88.85 41.25,88.85 42.65,90.25 43.55,90.25 v43.85,89.95
VDD_3V3  (via drill 0.35)
  Top 0.152: U1.70 79.62,71.03 80.72,69.93 R4.2 80.72,62.73 v81.9,61.55 82.6,61.55 83,61.15 83,60.61 C30.1 | R5.2 72.62,70.47 | v51.75,63.8 49.15,61.2 49.15,57.3 50.37,56.08 J2.1 50.37,53.45 52.17,51.65 R15.2 59.19,52.66 R11.2 | R7.2 19.93,66.17 v20.38,66.62 21.6,67.85 33.85,67.85 35.2,69.2 39.9,69.2 42.55,66.55 v43.15,66.55 41.75,66.55 41.3,66.1 41.3,65.7 42.85,64.15 42.85,62.85 41.9,61.9 41.15,61.9 40.22,60.97 C22.1 38.55,60.1 v38.5,60.05 | R9.2 19.3,71.29 C32.1 15.35,69.06 v15.35,68.7 | U3.39 35.16,58.54 v34.55,59.15 | v76.85,59.4 77.36,58.89 U4.39
  Top 0.254: 84.3,93.03 86.66,93.03 87.12,92.57 | 84.3,93.03 U1.108 81.47,93.03 80.95,93.55 80,93.55 78.95,92.5 78.95,86.65 | 87.12,92.57 SV1.1 | U1.31 65.18,78.03 | 65.18,78.03 v65.3,78.15 65.62,77.83 65.62,75.5 | U1.32 64.68,77.53 65.18,78.03 | U1.94 80.43,86.03 v80,85.6 | v85.65,84.35 85.65,82.79 R1.2 | 72.62,70.47 U1.56 72.62,75.27 78.55,81.2 | C9.2 86.67,92.57 87.12,92.57 | C8.1 85.84,94.57 84.3,93.03 | v80,85.6 78.95,86.65 | C5.2 74.12,96.45 74.12,96.35 | 74.12,96.35 U1.122 74.12,91.48 74.88,90.72 | 74.12,96.35 74.95,97.18 C2.1 | 78.95,86.65 74.88,90.72 | U1.135 67.62,93.08 | 74.88,90.72 69.97,90.72 67.62,93.08 | C4.1 56.55,93.17 56.55,89.92 | 66.52,91.98 65.56,91.03 U1.5 59.53,91.03 59.12,90.62 57.25,90.62 56.55,89.92 | 66.52,91.98 67.62,93.08 | C6.2 54.03,76.67 v53.25,77.45 | U1.16 63.58,85.53 66.52,88.47 66.52,91.98 | C3.1 56.55,89.92 | U1.42 65.62,75.5 | U1.70 79.62,74.53 78.55,75.6 78.55,81.2 | v80,85.6 78.55,84.15 78.55,81.2 | U1.43 66.12,75 65.62,75.5
  Top 0.508: SJ1.2 52.09,76.29 v53.25,77.45 | v65.3,78.15 72.75,85.6 v80,85.6 | C7.2 54.59,79.1 v53.6,79.1 | v15.35,68.7 14.75,68.1 TP3.TP
  Bottom 0.152: v15.35,68.7 17.43,66.62 v20.38,66.62 | v34.55,59.15 35.45,60.05 v38.5,60.05 | v76.85,59.4 78.55,61.1 81.45,61.1 v81.9,61.55 | v51.75,63.8 50.7,62.75 46.95,62.75 v43.15,66.55
  Bottom 0.254: v80,85.6 81,84.6 85.4,84.6 v85.65,84.35
  Bottom 0.508: v65.3,78.15 64.45,77.3 53.4,77.3 v53.25,77.45 | v53.25,77.45 53.25,65.3 v51.75,63.8 | v53.6,79.1 53.25,78.75 v53.25,77.45
VFERRITE
  Top 0.508: L3.2 51.36,91.96 D5.2
VLDO_33
  Top 0.508: U6.1 49.3,73.14 | 49.3,73.14 50.5,73.14 SJ1.1 | 49.3,73.14 47.45,71.3 C14.2
VOUT_33  (via drill 0.35)
  Top 0.254: v51.2,71.15 51.6,70.75 C12.2 | U1.21 64.52,83.03 v64.55,83
  Top 0.508: SJ1.3 53.61,70.06 52.8,69.25 C12.2
  Bottom 0.254: v64.55,83 65.1,82.45 65.1,81.4 63.6,79.9 52.35,79.9 51.2,78.75 v51.2,71.15
VSYS_5V  (via drill 0.35)
  Top 0.152: U4.43 75.36,57.94 74.86,58.44 | U4.44 74.86,58.44 | 74.86,58.44 74.73,58.57 74.32,58.57 70.78,62.11 C31.+
  Top 0.254: C27.1 81.74,52.18 U4.29 81.12,52.18 C26.1 | U4.20 76.36,42.39 v76.4,42.35 | v78.7,43.45 79.23,43.98 C25.1 | C24.1 72.1,44.66 v72.1,43.79 | U3.20 34.16,42.49 v34.3,42.35 | v37.5,43.3 37.5,44.98 C19.1 | C18.1 30.09,43.81 v30.4,43.5 | U3.29 39.15,52.18 | 39.15,52.18 39.3,52.18 C20.1 | 39.15,52.18 40.22,53.25 C21.1 | U3.38 35.66,57.96 35.9,58.2 | U3.37 36.16,57.94 35.9,58.2 | 35.9,58.2 35.9,59.71 | 35.9,59.71 C17.1 | C16.1 36.96,60.77 35.9,59.71 | U4.38 77.86,58.06 78.1,58.3 | U4.37 78.36,58.04 78.1,58.3 | C29.1 76.6,60.99 76.76,60.99 77.75,60 77.75,58.65 78.1,58.3 | 78.1,58.3 78.82,59.02 78.82,60.6 C28.1 | v64.1,81.7 63.27,82.53 U1.22
  Top 0.508: v78.7,43.45 82.2,43.45 82.3,43.55 | C26.1 82.3,50.56 82.3,43.55 | C19.1 43.35,45.07 | 43.35,45.07 43.72,45.07 46,47.35 46,57.35 | 82.3,43.55 87.8,49.05 87.8,55.7 v86,57.5 | C20.1 40.22,48.2 43.35,45.07 | D5.1 54.02,89.58 53.6,89.16 v53.6,88.8 | v42.7,57.95 45.4,57.95 46,57.35 | v37.1,59.3 36.96,59.44 C16.1 | v79.55,59.45 78.82,60.18 78.82,60.6 | 46,57.35 46,64.45 44.35,66.1 TP1.TP 44.4,68.85 44.4,72.3 43.55,73.14 U6.8 41.51,73.14 40.25,74.4 C13.2 38.15,76.09 39.06,77 v40.5,77 42.52,77 U6.5
  Bottom 0.254: v78.7,43.45 77.5,43.45 v76.4,42.35 74.96,43.79 v72.1,43.79 | v37.5,43.3 36.55,42.35 v34.3,42.35 31.55,42.35 v30.4,43.5 | 52.15,81.95 53.2,81.95 54.45,80.7 63.1,80.7 v64.1,81.7
  Bottom 0.508: 37.35,57.95 v42.7,57.95 45.5,55.15 56.5,55.15 58.6,57.25 67.26,57.25 C31.+ 74.56,57.5 79.9,57.5 | 37.35,57.95 33.36,57.95 C23.+ | 37.35,57.95 37.1,58.2 v37.1,59.3 | v86,57.5 79.9,57.5 | 79.9,57.5 79.55,57.85 v79.55,59.45 | v53.6,88.8 54.05,88.35 54.05,83.85 52.15,81.95 47.2,77 v40.5,77
XTAL
  Top 0.152: U1.73 82.51,75.55 84.49,75.55 Y1.1 C10.2
XTAL32
  Top 0.152: Y2.2 57.49,70.2 | 57.49,70.2 C34.1 | 57.49,70.2 58.2,70.2 58.6,70.6 58.6,71.85 58.95,72.2 64.25,72.2 64.62,72.57 U1.40

## Text on the board
tNames: JLCJLCJLCJLC | FlexEval